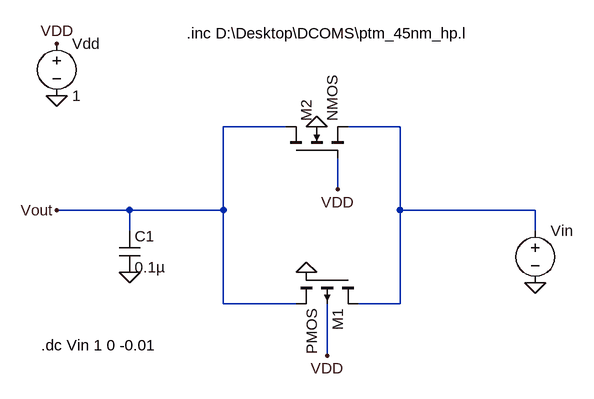
[diagram p0: schematic Discharging.asc]
Discharging.asc, the LTspice schematic file:
Version 4
SHEET 1 880 680
WIRE 128 -32 32 -32
WIRE 304 -32 224 -32
WIRE 208 64 208 16
WIRE -112 96 -224 96
WIRE 32 96 32 -32
WIRE 32 96 -112 96
WIRE 304 96 304 -32
WIRE 512 96 304 96
WIRE -112 128 -112 96
WIRE 512 128 512 96
WIRE 32 240 32 96
WIRE 144 240 32 240
WIRE 304 240 304 96
WIRE 304 240 240 240
WIRE 192 320 192 240
FLAG 512 208 0
FLAG -224 -80 0
FLAG 160 192 0
FLAG 176 -32 0
FLAG 208 64 VDD
FLAG 192 320 VDD
FLAG -224 -160 VDD
FLAG -112 192 0
FLAG -224 96 Vout
SYMBOL pmos4 240 192 R90
SYMATTR InstName M1
SYMATTR Value2 l=45nm w=180nm
SYMBOL nmos4 128 16 R270
SYMATTR InstName M2
SYMATTR Value2 l=45nm w=90nm
SYMBOL voltage 512 112 R0
SYMATTR InstName Vin
SYMATTR Value ""
SYMBOL voltage -224 -176 R0
WINDOW 123 0 0 Left 0
WINDOW 39 0 0 Left 0
SYMATTR InstName Vdd
SYMATTR Value 1
SYMBOL cap -128 128 R0
SYMATTR InstName C1
SYMATTR Value 0.1µ
TEXT -248 304 Left 2 !.dc Vin 1 0 -0.01
TEXT -24 -176 Left 2 !.inc D:\\Desktop\\DCOMS\\ptm_45nm_hp.l

The netlist it stands for:
* Discharging.asc
M1 N001 0 Vout VDD PMOS l=45nm w=180nm
M2 Vout VDD N001 0 NMOS l=45nm w=90nm
Vin N001 0
Vdd VDD 0 1
C1 Vout 0 0.1µ
.model NMOS NMOS
.model PMOS PMOS
.lib standard.mos
.dc Vin 1 0 -0.01
.inc D:\Desktop\DCOMS\ptm_45nm_hp.l
.backanno
.end